# EAGLE design logger (EAGLE 7.6.0)
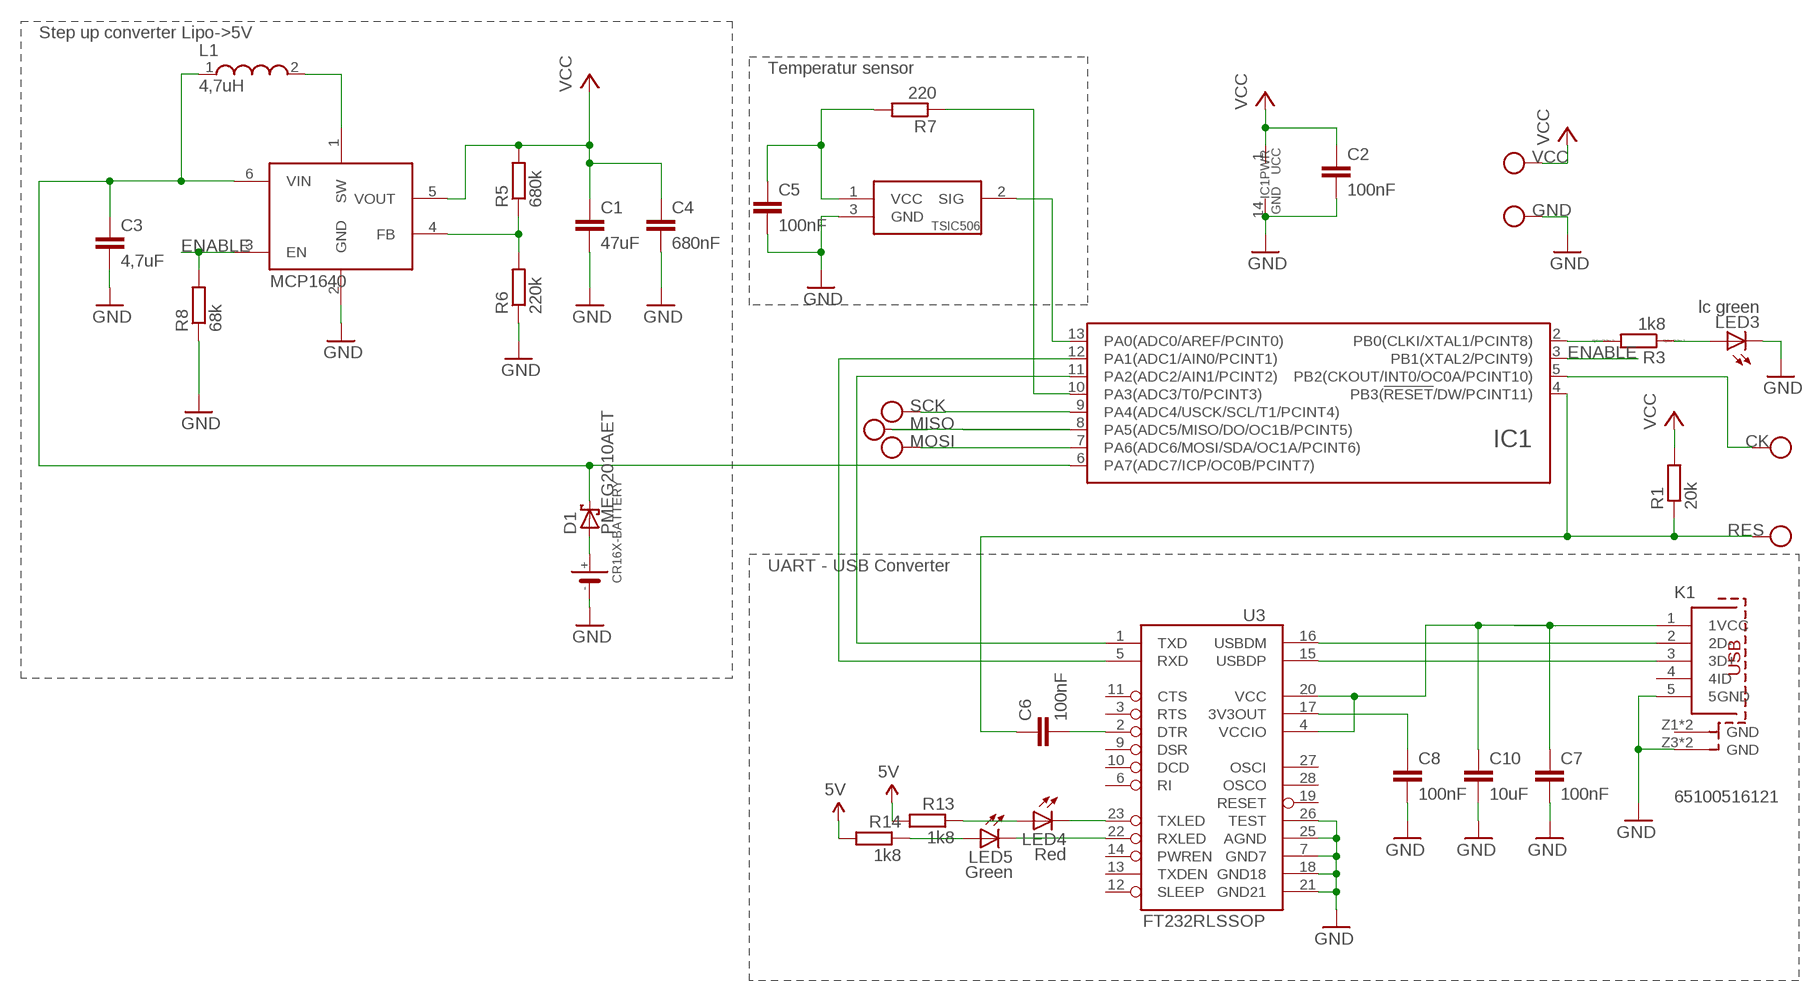
[diagram p0: schematic, sheet 1]

## Parts
C1  47uF  C-EUC1206  [C1206]
C2  100nF  C-EUC1206  [C1206]
C3  4,7uF  C-EUC1206  [C1206]
C4  680nF  C-EUC0805  [C0805]
C5  100nF  C-EUC0603  [C0603]
C6  100nF  C-EUC0603  [C0603]
C7  100nF  C-EUC1206  [C1206]
C8  100nF  C-EUC0603  [C0603]
C10  10uF  C-EUC1206  [C1206]
D1  PMEG2010AET  BAS70  [SOT23]
IC1  ATTINY24/44/84-SSU  [SOIC14]
K1  65100516121  [65100516121]
L1  4,7uH  WE-TPC_3816  [WE-TPC_3816]
LED3  lc green  LEDCHIPLED_0603  [CHIPLED_0603]
LED4  Red  LEDCHIPLED_0603  [CHIPLED_0603]
LED5  Green  LEDCHIPLED_0603  [CHIPLED_0603]
R1  20k  R-EU_R1206  [R1206]
R3  1k8  RR1206  [R1206]
R5  680k  R-EU_R1206  [R1206]
R6  220k  R-EU_R1206  [R1206]
R7  220  R-EU_R1206  [R1206]
R8  68k  R-EU_R1206  [R1206]
R13  1k8  R-EU_R1206  [R1206]
R14  1k8  R-EU_R1206  [R1206]
U1  MCP1640  [SOT23-6]
U3  FT232RLSSOP  [SSOP28DB]
U$1  CR16X-BATTERY  [16MM-BATTERY-HOLDER]
U$2  TSIC-506  [TO92]
U$7  PIN1.27  [PIN-1.27]
U$8  PIN1.27  [PIN-1.27]
U$9  PIN1.27  [PIN-1.27]
U$10  PIN1.27  [PIN-1.27]
U$11  PIN1.27  [PIN-1.27]
U$12  PIN1.27  [PIN-1.27]
U$13  PIN1.27  [PIN-1.27]

## Nets
CK: IC1.5(PB2(CKOUT/INT0/OC0A/PCINT10)) U$13.P$1
ENABLE: IC1.3(PB1(XTAL2/PCINT9)) R8.2 U1.3(EN)
GND: C1.2 C2.2 C3.2 C4.2 C5.2 C7.2 C8.2 C10.2 IC1.14(GND) K1.5(5GND) K1.Z3(GND) K1.Z4(GND) LED3.C R6.1 R8.1 U1.2(GND) U3.7(GND7) U3.18(GND18) U3.21(GND21) U3.25(AGND) U3.26(TEST) U$1.P$1 U$2.3(GND) U$10.P$1
MISO: IC1.8(PA5(ADC5/MISO/DO/OC1B/PCINT5)) U$7.P$1
MOSI: IC1.7(PA6(ADC6/MOSI/SDA/OC1A/PCINT6)) U$11.P$1
N$1: IC1.11(PA2(ADC2/AIN1/PCINT2)) U3.1(TXD)
N$2: IC1.13(PA0(ADC0/AREF/PCINT0)) U$2.2(SIG)
N$3: C8.1 U3.17(3V3OUT)
N$4: LED4.A R13.1
N$5: R5.1 R6.2 U1.4(FB)
N$6: D1.1(A) U$1.P$2
N$7: LED5.A R14.1
N$8: C6.2 U3.2(DTR)
N$9: IC1.10(PA3(ADC3/T0/PCINT3)) R7.1
N$10: C5.1 R7.2 U$2.1(VCC)
N$19: LED3.A R3.1
N$32: IC1.12(PA1(ADC1/AIN0/PCINT1)) U3.5(RXD)
RES: C6.1 IC1.4(PB3(!RESET!/DW/PCINT11)) R1.1 U$9.P$1
RXLED: LED5.C U3.22(RXLED)
SCK: IC1.9(PA4(ADC4/USCK/SCL/T1/PCINT4)) U$8.P$1
SW: L1.2 U1.1(SW)
TXLED: LED4.C U3.23(TXLED)
USB_D+: K1.3(3D+) U3.15(USBDP)
USB_D-: K1.2(2D-) U3.16(USBDM)
V+: IC1.2(PB0(CLKI/XTAL1/PCINT8)) R3.2
V_USB: C7.1 C10.1 K1.1(1VCC) R13.2 R14.2 U3.4(VCCIO) U3.20(VCC) ; supply symbol labelled 5V
VCC: C1.1 C2.1 C4.1 IC1.1(UCC) R1.2 R5.2 U1.5(VOUT) U$12.P$1
VSUPPLY: C3.1 D1.3(C) IC1.6(PA7(ADC7/ICP/OC0B/PCINT7)) L1.1 U1.6(VIN)
Unconnected: K1.4(4ID) K1.Z1(GND) K1.Z2(GND) U3.3(RTS) U3.6(RI) U3.9(DSR) U3.10(DCD) U3.11(CTS) U3.12(SLEEP) U3.13(TXDEN) U3.14(PWREN) U3.19(RESET) U3.27(OSCI) U3.28(OSCO)

## Notes on the sheet
- Step up converter Lipo->5V
- Temperatur sensor
- UART - USB Converter

## Library data of the parts
C1 C4 = resistor:C-EU: CAPACITOR, European symbol
C2 C3 C5-C8 C10 = rcl:C-EU: CAPACITOR, European symbol
D1 = diode:BAS70: Silicon Schottky Diodes General-purpose diode for high-speed switching
IC1 = atmel_tiny24-44-84tiny48-88mega48-88-168-328:ATTINY24/44/84; UCC: VCC
K1 = Input-Output_Connectors_rev15d:65100516121: WR-COM SMT Horizontal 5 Contacts Mini USB Typ B=>Code : Con_I-O_COM_MiniUSB_65100516121 <http://katalog.we-online.de/media/images/eican/Con_I-O_COM_MiniUSB_65100516121_pf2.jpg> Details see: http://katalog.we-online.de/en/em/651_005_161_21 Created 2014-07-09, Karrer Zheng 2014 (C) Würth Elektronik
L1 = EagleLibrary_Wuerth_Elektronik_eiSos_rev16a:WE-TPC: SMD Shielded Tiny Power Inductor Characteristics Extremely flat power inductor High current capability Magnetically shielded which results in a low leakage field Operating temperature: –40 °C to +125 °C Applications Portable power like PDA, digital camera, PCMCIA cards and displays DC/DC converter Embedded PC Mobile data gathering, telemetric <http://katalog.we-online.de/media/images/eisos/IndTPC_pf2.jpg> Details see: http://katalog.we-online.de/en/pbs/WE-TPC? Updated by Dan Xu 2014-07-11 2014 (C) Wurth Elektronik
LED3-LED5 = led:LED: LED OSRAM: - CHIPLED LG R971, LG N971, LY N971, LG Q971, LY Q971, LO R971, LY R971 LH N974, LH R974 LS Q976, LO Q976, LY Q976 LO Q996 - Hyper CHIPLED LW Q18S LB Q993, LB Q99A, LB R99A - SideLED LS A670, LO A670, LY A670, LG A670, LP A670 LB A673, LV A673, LT A673, LW A673 LH A674 LY A675 LS A676, LA A676, LO A676, LY A676, LW A676 LS A679, LY A679, LG A679 - Hyper Micro SIDELED® LS Y876, LA Y876, LO Y876, LY Y876 LT Y87S - SmartLED LW L88C, LW L88S LB L89C, LB L89S, LG L890 LS L89K, LO L89K, LY L89K LS L896, LA L896, LO L896, LY L896 - TOPLED LS T670, LO T670, LY T670, LG T670, LP T670 LSG T670, LSP T670, LSY T670, LOP T670, LYG T670 LG T671, LOG T671, LSG T671 LB T673, LV T673, LT T673, LW T673 LH T674 LS T676, LA T676, LO T676, LY T676, LB T676, LH T676, LSB T676, LW T676 LB T67C, LV T67C, LT T67C, LS T67K, LO T67K, LY T67K, LW E67C LS E67B, LA E67B, LO E67B, LY E67B, LB E67C, LV E67C, LT E67C LW T67C LS T679, LY T679, LG T679 LS T770, LO T770, LY T770, LG T770, LP T770 LB T773, LV T773, LT T773, LW T773 LH T774 LS E675, LA E675, LY E675, LS T675 LS T776, LA T776, LO T776, LY T776, LB T776 LHGB T686 LT T68C, LB T68C - Hyper Mini TOPLED® LB M676 - Mini TOPLED Santana® LG M470 LS M47K, LO M47K, LY M47K Source: http://www.osram.convergy.de LUXEON: - LUMILED® LXK2-PW12-R00, LXK2-PW12-S00, LXK2-PW14-U00, LXK2-PW14-V00 LXK2-PM12-R00, LXK2-PM12-S00, LXK2-PM14-U00 LXK2-PE12-Q00, LXK2-PE12-R00, LXK2-PE12-S00, LXK2-PE14-T00, LXK2-PE14-U00 LXK2-PB12-K00, LXK2-PB12-L00, LXK2-PB12-M00, LXK2-PB14-N00, LXK2-PB14-P00, LXK2-PB14-Q00 LXK2-PR12-L00, LXK2-PR12-M00, LXK2-PR14-Q00, LXK2-PR14-R00 LXK2-PD12-Q00, LXK2-PD12-R00, LXK2-PD12-S00 LXK2-PH12-R00, LXK2-PH12-S00 LXK2-PL12-P00, LXK2-PL12-Q00, LXK2-PL12-R00 Source: www.luxeon.com KINGBRIGHT: KA-3528ASYC Source: www.kingbright.com
R1 R13 R14 = rcl:R-EU_: RESISTOR, European symbol
R3 = eagle-ltspice:R: RESISTOR, European symbol; SPICEMODEL: NONE; SPICEPREFIX: R
R5-R8 = resistor:R-EU_: RESISTOR, European symbol
U1 = karlnet-parts:MCP1640: MCP1623, 1624, 1640/B/C/D pwm/pfm or pwm only DC/DC converters, in SOT-23
U3 = SparkFun:FT232RL: USB UART FT232RL 4th Generation USB UART (USB <-> Serial) Controller. Spark Fun Electronics SKU : COM-00650
U$1 = 0liver:CR16X-BATTERY
U$2 = 0liver:TSIC-506
U$7-U$13 = 0liver:PIN

## Board
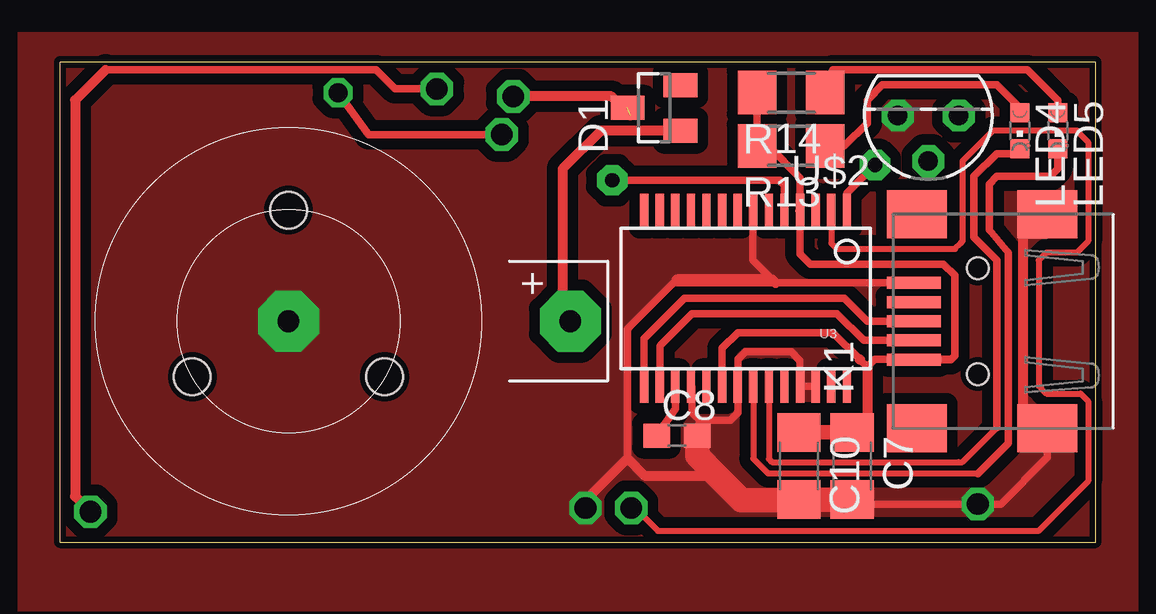
[diagram p1: board, top side]
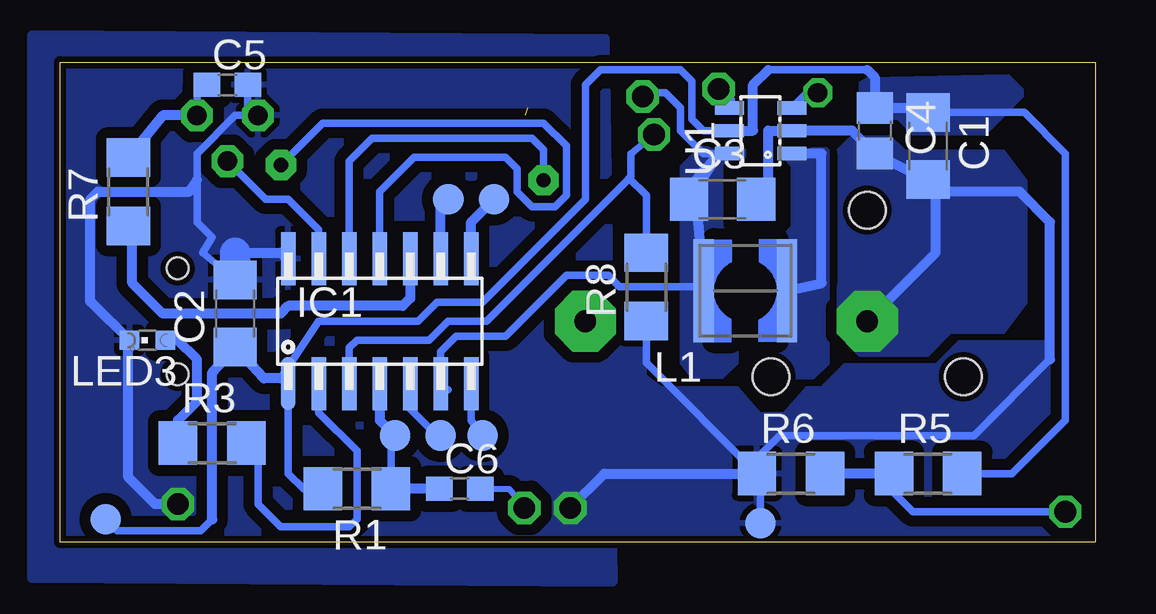
[diagram p2: board, bottom side, seen from below]

Size 43.17 x 20 mm. Coordinates in mm from the lower left corner, seen from the top.
Outline: 0,0 43.17,0 43.17,20 0,20 0,0
Copper layers (1*16): Top 0.035mm / dielectric 1.5mm / Bottom 0.035mm
Design rules "default *": minimum track width 10mil, minimum drill 24mil, track to track 18mil, track to pad 18mil, pad to pad 18mil, via to via 18mil, smd to smd 8mil, copper to edge 10mil, drill to drill 8mil, minimum pad ring 10mil, minimum via ring 8mil, stop-mask expansion 4mil, vias tented up to drill 0mil, thermal gap 10mil

### Footprints (pad centres in the part's own frame; a part is rotated, then mirrored left to right if it is on the bottom)
C1206 = smd 1.6 x 1.8: 1 -1.4,0; 2 1.4,0
C0805 = smd 1.3 x 1.5: 1 -0.95,0; 2 0.95,0
C0603 = smd 1.1 x 1: 1 -0.85,0; 2 0.85,0
SOT23 = smd 1 x 1.4: 1 -0.95,-1.1; 2 0.95,-1.1; 3 0,1.1
SOIC14 = smd 0.61 x 2.21: 1 -3.81,-2.603; 2 -2.54,-2.603; 3 -1.27,-2.603; 4 0,-2.603; 5 1.27,-2.603; 6 2.54,-2.603; 7 3.81,-2.603; 8 3.81,2.603; 9 2.54,2.603; 10 1.27,2.603; 11 0,2.603; 12 -1.27,2.603; 13 -2.54,2.603; 14 -3.81,2.603
65100516121 = smd 0.5 x 2.25: 1 -1.6,5.685; 2 -0.8,5.685; 3 0,5.685; 4 0.8,5.685; 5 1.6,5.685 | smd 2 x 2.5: Z1 -4.45,5.56; Z2 4.45,5.56; Z3 4.45,0.11; Z4 -4.45,0.11 | hole 0.9: -2.2,3.01; 2.2,3.01
WE-TPC_3816 = smd 0.85 x 4.3: 1 -1.731,0; 2 1.731,0
CHIPLED_0603 = smd 0.8 x 0.8: A 0,-0.75; C 0,0.75
R1206 = smd 1.6 x 1.803: 1 -1.422,0; 2 1.422,0
SOT23-6 = smd 0.55 x 1.2: 1 -0.95,-1.3; 2 0,-1.3; 3 0.95,-1.3; 4 0.95,1.3; 5 0,1.3; 6 -0.95,1.3
SSOP28DB = smd 0.348 x 1.397: 1 -4.225,-3.656; 2 -3.575,-3.656; 3 -2.925,-3.656; 4 -2.275,-3.656; 5 -1.625,-3.656; 6 -0.975,-3.656; 7 -0.325,-3.656; 8 0.325,-3.656; 9 0.975,-3.656; 10 1.625,-3.656; 11 2.275,-3.656; 12 2.925,-3.656; 13 3.575,-3.656; 14 4.225,-3.656; 15 4.225,3.656; 16 3.575,3.656; 17 2.925,3.656; 18 2.275,3.656; 19 1.625,3.656; 20 0.975,3.656; 21 0.325,3.656; 22 -0.325,3.656; 23 -0.975,3.656; 24 -1.625,3.656; 25 -2.275,3.656; 26 -2.925,3.656; 27 -3.575,3.656; 28 -4.225,3.656
16MM-BATTERY-HOLDER = drill 0.9 pad 2.54 octagon: P$1 0,0; P$2 11.75,0 | hole 1.52: 4.01,-2.315; -4.01,-2.315; 0,4.63
TO92 = drill 0.813 octagon: 1 -1.27,0; 2 0,1.905; 3 1.27,0
PIN-1.27 = smd 1.27 x 1.27: P$1 0,0

### Placement (x,y rotation side)
C1  6.99,16.51 270 bottom
C2  35.88,9.53 90 bottom
C3  15.56,14.29 0 bottom
C4  9.21,17.14 270 bottom
C5  36.2,19.05 0 bottom
C6  26.51,2.22 0 bottom
C7  33.02,3.17 270 top
C8  25.72,4.45 0 top
C10  30.8,3.17 270 top
D1  24.77,18.1 90 top
IC1  29.84,9.21 0 bottom
K1  41.27,9.21 90 top
L1  14.61,10.48 0 bottom
LED3  39.53,8.41 90 bottom
LED4  40.01,17.14 180 top
LED5  41.59,17.14 180 top
R1  30.8,2.22 180 bottom
R3  36.83,4.13 0 bottom
R5  6.99,2.86 0 bottom
R6  12.7,2.86 0 bottom
R7  40.32,14.61 90 bottom
R8  18.73,10.64 90 bottom
R13  30.48,16.51 180 top
R14  30.48,18.73 180 top
U1  13.97,17.14 90 bottom
U3  28.57,10.16 180 top
U$1  9.53,9.21 0 top
U$2  36.2,17.78 180 top
U$7  25.08,14.29 0 bottom
U$8  26.99,14.29 0 bottom
U$9  29.21,4.45 0 bottom
U$10  13.97,0.79 0 bottom
U$11  25.56,4.45 0 bottom
U$12  41.27,0.95 0 bottom
U$13  27.3,4.45 0 bottom

### Tracks (layer width: path | path; a pad name or v marks a point on that pad's centre or on a via)
CK
  Bottom 0.305: U$13.P$1 27.46,4.45 28.57,5.56 IC1.5
ENABLE  (via drill 0.8, 0.9)
  Top 0.305: v11.59,18.73 12.86,16.99 17.94,16.99 18.26,17.3 v18.41,16.99
  Bottom 0.305: IC1.3 31.11,8.1 30.8,8.41 27.78,8.41 26.99,9.21 25.4,9.21 19.53,15.08 19.45,15.16 | 19.45,15.16 19.37,15.24 19.37,16.19 v18.41,16.99 | U1.3 12.06,18.7 11.91,18.73 v11.59,18.73 | R8.2 18.73,14.45 19.45,15.16
FILL
  pour Bottom: 20.45,20.96 44.35,21.12 44.35,-1.48 20.13,-1.64
  pour Top (no thermals): -1.75,21.25 44.93,21.25 44.93,-2.88 -1.75,-2.88
GND  (via drill 0.9)
  Top 0.305: U3.26 U3.25 30.85,7.57 30.48,7.94 28.57,7.94 28.26,7.62 28.26,7.15 U3.21 28.26,5.4 27.94,5.08 26.67,5.08 | 26.67,5.08 26.35,5.4 26.35,6.45 U3.18 | 26.67,5.08 26.57,4.55 C8.2 | K1.5 29.83,10.81 | 29.83,10.81 28.89,11.75 28.89,13.81 U3.7 | 29.83,10.81 25.73,10.81 | 25.72,10.95 23.65,8.89 23.65,3.49 | 32.38,1.77 32.57,1.59 v38.26,1.59 39.21,1.59 41.16,3.54 K1.Z4
  Top 0.406: 29.83,10.81 29.69,10.95 25.72,10.95 | v21.91,1.43 21.91,1.75 23.65,3.49 24.37,2.78 27.38,2.78 | K1.Z4 40.16,4.76 40.16,12.86 41.16,12.86 K1.Z3
  Top 1.016: C7.2 32.38,1.77 C10.2 30.77,1.75 28.42,1.75 27.38,2.78 26.57,3.6 C8.2
  Bottom 0.305: 13.65,14.61 13.97,14.61 C3.2 | 14.44,3.17 R6.1 | C5.2 35.34,18.2 U$2.3 35.88,17.78 37.47,16.19 37.47,15.08 37.47,13.34 36.83,12.7 37.23,12.06 C2.2 | U$10.P$1 13.97,2.54 13.97,2.71 arc-90 R6.1 | R8.1 18.73,7.47 R6.1 | 1.91,7.62 5.08,4.45 13.18,4.45 14.12,3.5 R6.1
  Bottom 0.406: 33.97,12.06 IC1.14 | 9.21,9.53 U$1.P$1 6.67,12.06 6.67,14.61 | 6.67,14.92 C4.2 10.16,17.14 U1.2 13.65,17.14 13.65,14.92 13.97,14.61 | 6.67,14.92 C1.2 | 6.67,14.61 6.67,14.92 | 14.61,2.22 R6.1 | R6.1 13.97,2.54 | 1.91,7.62 1.91,13.34 3.17,14.61 6.67,14.61 | v21.91,1.43 20.48,2.86 R6.1 | 37.47,15.08 37.78,14.61 41.59,14.61 41.91,14.29 41.91,10 41.87,10 LED3.C 40.32,8.37 40.32,2.7 39.21,1.59 v38.26,1.59 | 35.88,12.06 33.81,12.06 | 33.81,12.06 33.66,12.06 33.66,11.91 33.81,11.91 33.81,12.06
  Bottom 1.27: C2.2 35.88,12.06
  pour Bottom (no thermals): 8.57,16.96 10.16,16.96 10.79,16.33 10.79,8.71 9.84,7.75 6.99,7.75 6.03,8.71 3.81,8.71 2.86,9.98 2.86,15.06 3.81,16.33 7.94,16.33
  pour Bottom: 1.27,7.75 1.91,8.39 5.71,8.39 6.67,7.44 10.48,7.44 11.43,6.49 12.06,6.49 13.02,5.4 13.97,5.4 14.92,6.49 18.1,6.49 18.73,6.96 18.73,19.98 44.29,19.98 44.29,-0.98 1.91,-0.82 1.27,-0.18
  pour Top (no thermals): -2.54,21.73 44.13,21.73 44.13,-2.4 -2.54,-2.4
MISO
  Bottom 0.406: IC1.8 26.04,13.34 U$7.P$1
MOSI
  Bottom 0.305: IC1.7 26.04,5.08 U$11.P$1
N$1  (via drill 0.6 pad 1.27)
  Top 0.305: U3.1 32.8,14.54 v33.97,15.72
  Bottom 0.305: v33.97,15.72 32.23,17.46 23.02,17.46 22.07,16.51 22.07,14.45 22.54,13.97 23.5,13.97 23.81,14.29 24.13,14.61 24.13,15.56 24.61,16.03 25.56,16.03 28.42,16.03 29.84,14.61 IC1.11
N$2
  Bottom 0.305: IC1.13 32.38,13.02 33.66,14.29 34.61,14.29 U$2.2
N$3
  Top 0.305: U3.17 25.65,5.57 C8.1
N$4
  Top 0.305: LED4.A 40.01,18.1 39.05,19.05 34.29,19.05 33.66,18.41 33.66,17.46 32.7,16.51 R13.1
N$5  (via drill 0.9)
  Top 0.305: v15.72,18.89 13.97,18.89 13.18,19.68 5.4,19.68 1.91,19.68
  Top 0.406: 1.91,19.68 0.64,18.41 0.64,1.91 v1.27,1.27
  Bottom 0.305: v1.27,1.27 7.62,1.27 8.57,2.22 8.57,3.49 R5.1
  Bottom 0.406: U1.4 15.24,18.41 v15.72,18.89 | R5.1 R6.2
N$6
  Top 0.406: D1.1 22.55,17.15 20.95,15.56 20.95,9.53 U$1.P$2
N$7
  Top 0.305: LED5.A 41.59,18.41 40.32,19.68 32.22,19.68 R14.1
N$8  (via drill 0.9 pad 1.02)
  Top 0.254: U3.2 32.15,12.46 32.38,12.22 37.31,12.22 37.54,12.46 | 37.54,12.46 37.62,12.54 | v23.81,1.43 23.97,1.43 24.92,0.48 40.8,0.48 42.7,2.38 42.86,2.54 42.86,5.87 42.55,6.19 41.12,6.19 40.8,6.51 40.8,11.75 41.12,12.06 42.39,12.06 42.86,12.54 42.86,16.67 42.39,17.14 38.89,17.14 37.62,15.88 37.62,12.54 | 37.62,12.54 37.54,12.46
  Bottom 0.254: C6.2 24.45,2.22 v23.81,1.43
N$9
  Bottom 0.406: 40.32,13.34 R7.1 40.16,13.02 40.16,10.79 38.89,9.53 33.97,9.53 33.66,9.84 28.89,9.84 28.57,10.16 IC1.10
N$10
  Bottom 0.305: C5.1 37.47,18.95 U$2.1
  Bottom 0.406: U$2.1 38.89,17.78 R7.2
N$19
  Bottom 0.406: R3.1 38.25,5.09 37.47,5.87 37.47,7.62 38.26,8.41 38.85,8.41 LED3.A
N$32  (via drill 0.6 pad 1.27)
  Top 0.305: U3.5 30.2,14.88 30.16,14.92 30,15.08 23.5,15.08 v23.02,15.08
  Bottom 0.305: IC1.12 31.11,15.88 30.16,16.83 24.45,16.83 23.5,16.83 23.02,16.35 v23.02,15.08
RES
  Bottom 0.305: U$9.P$1 29.38,4.28 R1.1
  Bottom 0.406: IC1.4 29.84,5.08 U$9.P$1 | C6.1 R1.1
RXLED
  Top 0.254: 28.9,6.34 28.9,3.48 29.37,3.02 29.53,2.86 38.26,2.86
  Top 0.305: U3.22 28.9,6.34 | LED5.C 41.59,15.56 41.27,15.24 39.05,15.24 38.73,14.92 38.73,13.02 39.53,12.06 39.53,6.51 39.53,6.35 39.53,4.13 38.26,2.86
SCK
  Bottom 0.406: IC1.9 27.3,13.97 U$8.P$1
SW
  Bottom 0.406: L1.2 11.43,10.79 11.43,16.19 12.06,16.19 U1.1
  pour Bottom (no thermals): 13.02,16.64 13.02,16.01 12.7,15.69 12.7,13.15 13.02,12.84 13.97,12.84 14.29,12.52 14.29,7.44 13.65,6.8 11.75,6.8 11.11,7.44 11.11,16.33 11.43,16.64
TXLED
  Top 0.254: 29.55,6.33 29.55,3.47 29.69,3.33 37.47,3.33 37.62,3.33 39.05,4.76
  Top 0.305: U3.23 29.55,6.33 | 39.05,4.76 39.05,11.75 38.1,12.7 38.1,15.24 39.05,16.19 39.8,16.19 LED4.C
USB_D+
  Top 0.305: U3.15 24.35,8.47 25.08,9.21 26.04,10.16 32.7,10.16 33.66,9.21 K1.3
USB_D-
  Top 0.305: U3.16 25,8.17 25.08,8.26 25.23,8.41 26.35,9.53 32.38,9.53 33.5,8.41 K1.2
V+
  Bottom 0.305: R3.2 34.92,3.64 34.92,1.59 33.97,0.64 31.11,0.64 30.8,0.95 30.8,3.81 32.38,5.4 IC1.2
V_USB
  Top 0.305: 35.6,7.62 K1.1 37.13,7.61 37.15,7.62 | R14.2 R13.2 29.53,16.51 30.85,15.19 U3.4 | U3.4 30.8,13.82 30.8,13.81 | U3.4 30.85,12.01 31.27,11.59 36.83,11.59 37.31,11.11 37.31,7.78 37.15,7.62 | 37.15,7.62 33.97,7.62 33.66,7.3 33.35,7.61 | U3.20 27.6,8.07 28.26,8.73 32.23,8.73 33.34,7.62
  Top 0.406: 33.35,7.61 33.34,7.62 | 33.66,7.3 33.66,5.21 C7.1
  Top 0.61: C10.1 C7.1
VCC
  Bottom 0.305: 13.65,19.68 9.53,19.68 | R5.2 3.49,2.86 1.27,5.08 1.27,16.19 2.99,17.91 C1.1 | R1.2 33.02,2.22 33.66,2.86 IC1.1 33.97,6.83 32.38,9.21 28.26,9.21 27.46,10 25.56,10 21.27,14.29 21.27,19.05 20.64,19.68 17.3,19.68 16.83,19.21 16.83,17.62 16.35,17.14 U1.5 | 36.83,0.95 37.31,0.48 40.8,0.48 U$12.P$1
  Bottom 0.406: U1.5 14.29,17.14 14.29,19.05 13.65,19.68 | 9.53,19.68 9.21,19.37 C4.1 | C4.1 | C4.1 6.99,18.1 C1.1 6.99,17.46 | 33.97,6.83 34.68,6.83 C2.1 36.83,7.07 36.83,0.95
  pour Bottom (no thermals): 4.6,16.96 7.62,16.96 8.26,17.6 9.53,17.6 9.84,17.91 9.84,19.18 9.53,19.37 3.65,19.5 3.02,18.87 3.02,18.55
VSUPPLY  (via drill 0.9)  (1 unrouted)
  Top 0.406: 23.77,17.78 22.98,18.57 v18.89,18.57
  Bottom 0.305: 26.99,6.35 IC1.6 27.3,7.94 26.67,8.57 24.61,8.57 22.07,11.11 20.32,11.11 19.84,10.64 16.5,10.64 L1.1 | 15.72,16.19 16.35,16.19 17.3,17.14 17.3,18.1 17.94,18.73 18.89,18.73 v18.89,18.57
  Bottom 0.406: U1.6 15.72,16.19 | 15.72,16.19 C3.1 16.67,14.29 L1.1 | 17.46,14.29 16.83,14.92 15.72,16.19
  pour Bottom (no thermals): 14.61,16.53 14.61,16.01 15.24,16.01 15.56,15.69 15.56,13.15 14.92,12.52 14.92,7.44 15.56,6.8 16.83,6.8 17.3,7.44 17.3,15.69 16.44,16.53 16.33,16.53

### Text on the board
Top: Temperatur Logger V2.3 12/2016
Bottom: Temperatur Logger V2.3 12/2016